# Altium schematic sheet connector.SchDoc
size A4; SheetNumber: 5; SheetTotal: 8
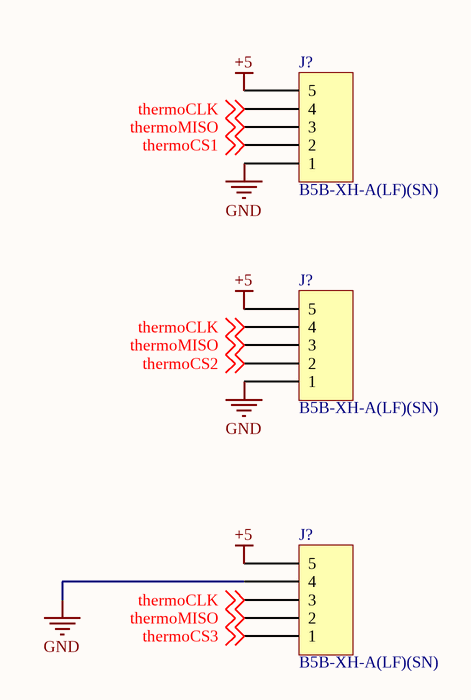
[diagram p0: connector.SchDoc]

## Parts
(Parts that share a designator on the sheet are numbered #1, #2 ... from top to bottom, then left to right.)
J?#1  B5B-XH-A(LF)(SN)  [JST XH B5B-XH-A]
J?#2  B5B-XH-A(LF)(SN)  [JST XH B5B-XH-A]
J?#3  B5B-XH-A(LF)(SN)  [JST XH B5B-XH-A]

## Nets
+5: J?#1.5 J?#2.5 J?#3.5
GND: J?#1.1 J?#2.1 J?#3.4
thermoCLK: J?#1.4 J?#2.4 J?#3.3 ; off-sheet thermoCLK
thermoCS1: J?#1.2 ; off-sheet thermoCS1
thermoCS2: J?#2.2 ; off-sheet thermoCS2
thermoCS3: J?#3.1 ; off-sheet thermoCS3
thermoMISO: J?#1.3 J?#2.3 J?#3.2 ; off-sheet thermoMISO

## Library data of the parts
J?#1-J?#3 = B5B-XH-A(LF)(SN): CONN HEADER VERT 5POS 2.5MM; Manufacturer: JST Sales America Inc.; Contact Length - Post: 0.134" (3.40mm); Current Rating (Amps): 3A; Material Flammability Rating: UL94 V-0; Number of Positions: 5; Number of Positions Loaded: All; Pitch - Mating: 0.098" (2.50mm); Shrouding: Shrouded - 4 Wall; Style: Board to Cable/Wire; Voltage Rating: 250V; Part Number: B5B-XH-A(LF)(SN); ComponentLink1Description: Datasheet; ComponentLink1URL: http://www.jst-mfg.com/product/pdf/eng/eXH.pdf; ComponentLink2Description: DigiKey Link; ComponentLink2URL: http://digikey.com/product-detail/en/jst-sales-america-inc/B5B-XH-A-LF-SN/455-2270-ND/1530483; Connector Type: Header; Contact Finish - Mating: Tin; Contact Finish - Post: Tin; Contact Material: Brass; Contact Shape: Square; Contact Type: Male Pin; Fastening Type: Detent Lock; Insulation Color: Natural; Insulation Height: 0.276" (7.00mm); Insulation Material: Polyamide (PA66), Nylon 6/6; LastUpdated: 12.01.2020 23:46:46; Lifecycle Status: Active; Minimum Order: 1; Mounting Type: Through Hole; Number of Rows: 1; Operating Temperature: -25°C ~ 85°C; Packaging: Bulk; PartId: 70; Part Status: Active; Price: 0.25; Series: XH; Supplier 1: DigiKey; Supplier Part Number 1: 455-2270-ND; Termination: Press-Fit, Solder